# Altium schematic sheet PwrSupply.SchDoc
size A; SheetNumber: 1; SheetTotal: 1
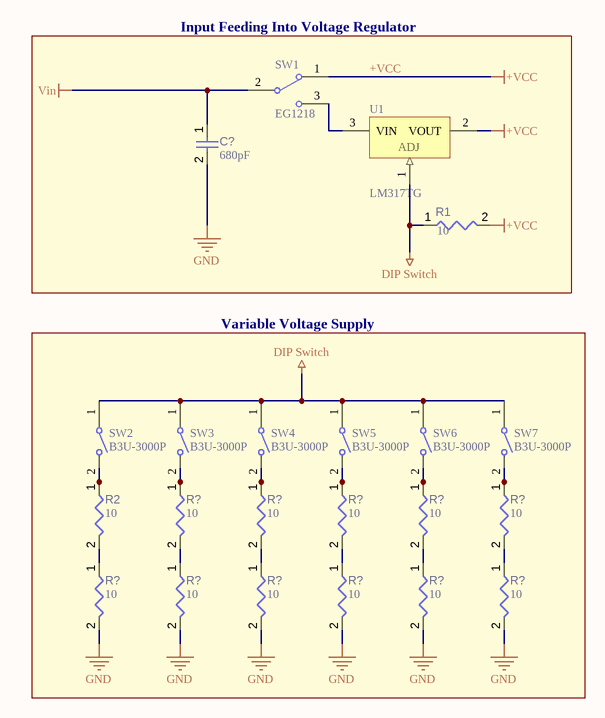
[diagram p0: PwrSupply.SchDoc]

## Parts
(Parts that share a designator on the sheet are numbered #1, #2 ... from top to bottom, then left to right.)
C?  value 680pF  [CAPC0402(1005)33_L]  (hidden comment: Capacitor 680pF +/-20% 50V 0402)
R1  value 10  [RESC0402(1005)_L]  (hidden comment: Resistor 10R  +/-1 % 0402 63 mW)
R2  value 10  [RESC0402(1005)_L]  (hidden comment: Resistor 10R  +/-1 % 0402 63 mW)
R?#1  value 10  [RESC0402(1005)_L]  (hidden comment: Resistor 10R  +/-1 % 0402 63 mW)
R?#2  value 10  [RESC0402(1005)_L]  (hidden comment: Resistor 10R  +/-1 % 0402 63 mW)
R?#3  value 10  [RESC0402(1005)_L]  (hidden comment: Resistor 10R  +/-1 % 0402 63 mW)
R?#4  value 10  [RESC0402(1005)_L]  (hidden comment: Resistor 10R  +/-1 % 0402 63 mW)
R?#5  value 10  [RESC0402(1005)_L]  (hidden comment: Resistor 10R  +/-1 % 0402 63 mW)
R?#6  value 10  [RESC0402(1005)_L]  (hidden comment: Resistor 10R  +/-1 % 0402 63 mW)
R?#7  value 10  [RESC0402(1005)_L]  (hidden comment: Resistor 10R  +/-1 % 0402 63 mW)
R?#8  value 10  [RESC0402(1005)_L]  (hidden comment: Resistor 10R  +/-1 % 0402 63 mW)
R?#9  value 10  [RESC0402(1005)_L]  (hidden comment: Resistor 10R  +/-1 % 0402 63 mW)
R?#10  value 10  [RESC0402(1005)_L]  (hidden comment: Resistor 10R  +/-1 % 0402 63 mW)
R?#11  value 10  [RESC0402(1005)_L]  (hidden comment: Resistor 10R  +/-1 % 0402 63 mW)
SW1  EG1218  [ESWI-EG1218_V]
SW2  B3U-3000P  [OMRON-B3U-3000P_V]
SW3  B3U-3000P  [OMRON-B3U-3000P_V]
SW4  B3U-3000P  [OMRON-B3U-3000P_V]
SW5  B3U-3000P  [OMRON-B3U-3000P_V]
SW6  B3U-3000P  [OMRON-B3U-3000P_V]
SW7  B3U-3000P  [OMRON-B3U-3000P_V]
U1  LM317TG  [ONSC-TO-220-3-221AB-01]

## Blocks framed on the sheet
Input Feeding Into Voltage Regulator: C? R1 SW1 U1
Variable Voltage Supply: R2 R?#1-R?#11 SW2-SW7

## Nets
+VCC: R1.2 SW1.1 U1.2(VOUT)
DIP Switch: R1.1 SW2.1 SW3.1 SW4.1 SW5.1 SW6.1 SW7.1 U1.1(ADJ)
GND: C?.2 R?#6.2 R?#7.2 R?#8.2 R?#9.2 R?#10.2 R?#11.2
Vin: C?.1 SW1.2(COM)
NetR2_1: R2.1 SW2.2
NetR2_2: R2.2 R?#6.1
NetR?#1_1: R?#1.1 SW3.2
NetR?#1_2: R?#1.2 R?#7.1
NetR?#2_1: R?#2.1 SW4.2
NetR?#2_2: R?#2.2 R?#8.1
NetR?#3_1: R?#3.1 SW5.2
NetR?#3_2: R?#3.2 R?#9.1
NetR?#4_1: R?#4.1 SW6.2
NetR?#4_2: R?#4.2 R?#10.1
NetR?#5_1: R?#5.1 SW7.2
NetR?#5_2: R?#5.2 R?#11.1
NetSW1_3: SW1.3 U1.3(VIN)

## Library data of the parts
C? = CMP-001-00070-3: Chip Capacitor, 680pF +/-20%, 50V, 0402, Thickness 0.33 mm; Tolerance: 10%; Max Operating Temperature: 85°C; Pins: 2; Min Operating Temperature: -55°C; Voltage Rating: 50V; Mounting Technology: SMT; Case/Package: 0402
R1 R2 R?#1-R?#11 = CMP-009-00152-3: Chip Resistor, 10 Ohms, +/-1 %, 63 mW, -55 to 155 degC, 0402; Tolerance: 1%; Power: 63mW; Pins: 2; Max Operating Temperature: 155°C; Min Operating Temperature: -55°C; Case/Package: 0402
SW1 = CMP-011-00006-2: Slide Switch, SPDT, 500 V, -20 to 70 degC, 3-Pin THD, RoHS, Bulk; Manufacturer: E-Switch; Voltage Rating (DC): 30V; Current Rating: 200mA; Operating Force: 250gf; Package Quantity: 1000; Contact Plating: Silver; Max Operating Temperature: 70°C; Min Operating Temperature: -20°C; Contact Material: Copper; Datasheet URL: https://www.e-switch.com/system/asset/product_line/data_sheet/119/EG.pdf; Contact Finish: Silver; Case/Package: EG1218; Voltage Rating (AC): 30V; Datasheet Version: Oct-15; Package Description: 3-Pin Through Hole Device, Body 11.6 x 4 mm, Pitch 2.5 mm; RoHS Compliant: True; Package Reference: EG1218; Manufacturer URL: http://www.e-switch.ch/en/; Throw Configuration: SPDT; Contact Current Rating: 200mA; Mounting Technology: TH; Packaging: Bulk; Pins: 3
SW2-SW7 = CMP-011-00005-2: Tactile Switch, SPST-NO, 0.05 A, 12 V, -25 to 70 degC, 2-Pin SMD, RoHS, Tape and Reel; Manufacturer: Omron Electronic Components; Operating Force: 162gf; Voltage Rating (DC): 12V; Current Rating: 50mA; IP Rating: IP40; Throw Configuration: SPST; Max Contact Resistance: 100mohm; RoHS Compliant: True; Contact Current Rating: 50mA; Manufacturer URL: http://www.omron.com/; Packaging: TapeandReel; Max Voltage Rating (DC): 12V; Contact Material: Silver; Datasheet Version: Jan-15; Package Reference: B3U-3000P; Package Description: 2-Pin Surface Mount Device, Body 4 x 3.2 mm; Min Operating Temperature: -25°C; Package Quantity: 4000; Max Operating Temperature: 70°C; Max Current Rating: 50mA; Voltage Rating: 12V; Case/Package: B3U-3000P; Mounting Technology: SM; Datasheet URL: https://www.omron.com/ecb/products/pdf/en-b3u.pdf
U1 = CMP-019-00023-3: Adjustable Output, Positive Voltage Regulator, 1.5 A, 0 to 125 degC, 3-Pin TO-220 (221AB-01), Pb-Free, Rail; Manufacturer: ON Semiconductor; Outputs: 1; Max Input Voltage: 40V; Min Input Voltage: 4.2V; Output Current: 1.5A; Output Voltage: 1.2V; Package Version: Rev. A, 11/2010; Mounting Technology: TH; Case/Package: TO-220; Package Description: 3-Pin Flange Mount, Vertical Straight Lead, Body 9.97 x 4.445 mm, Pitch 2.54 mm; Package Reference: TO-220-3-221AB-01; Manufacturer URL: http://www.onsemi.com/; Package Quantity: 50; Datasheet Version: Rev. 14, 01/2016; Max Ouput Current: 1.5A; Min Operating Temperature: 0°C; Packaging: Rail/Tube; Datasheet URL: http://www.onsemi.com/pub_link/Collateral/LM317-D.PDF; Max Operating Temperature: 125°C; RoHS Compliant: True; Pins: 3